# EasyEDA schematic PCB 10.2_2020-06-05_09-00-42.json
TITLE: Sheet_1; REV: 1.0; Date: 2020-06-05; Sheet: 1/1; Drawn By: Pravindu; Company: Your Company
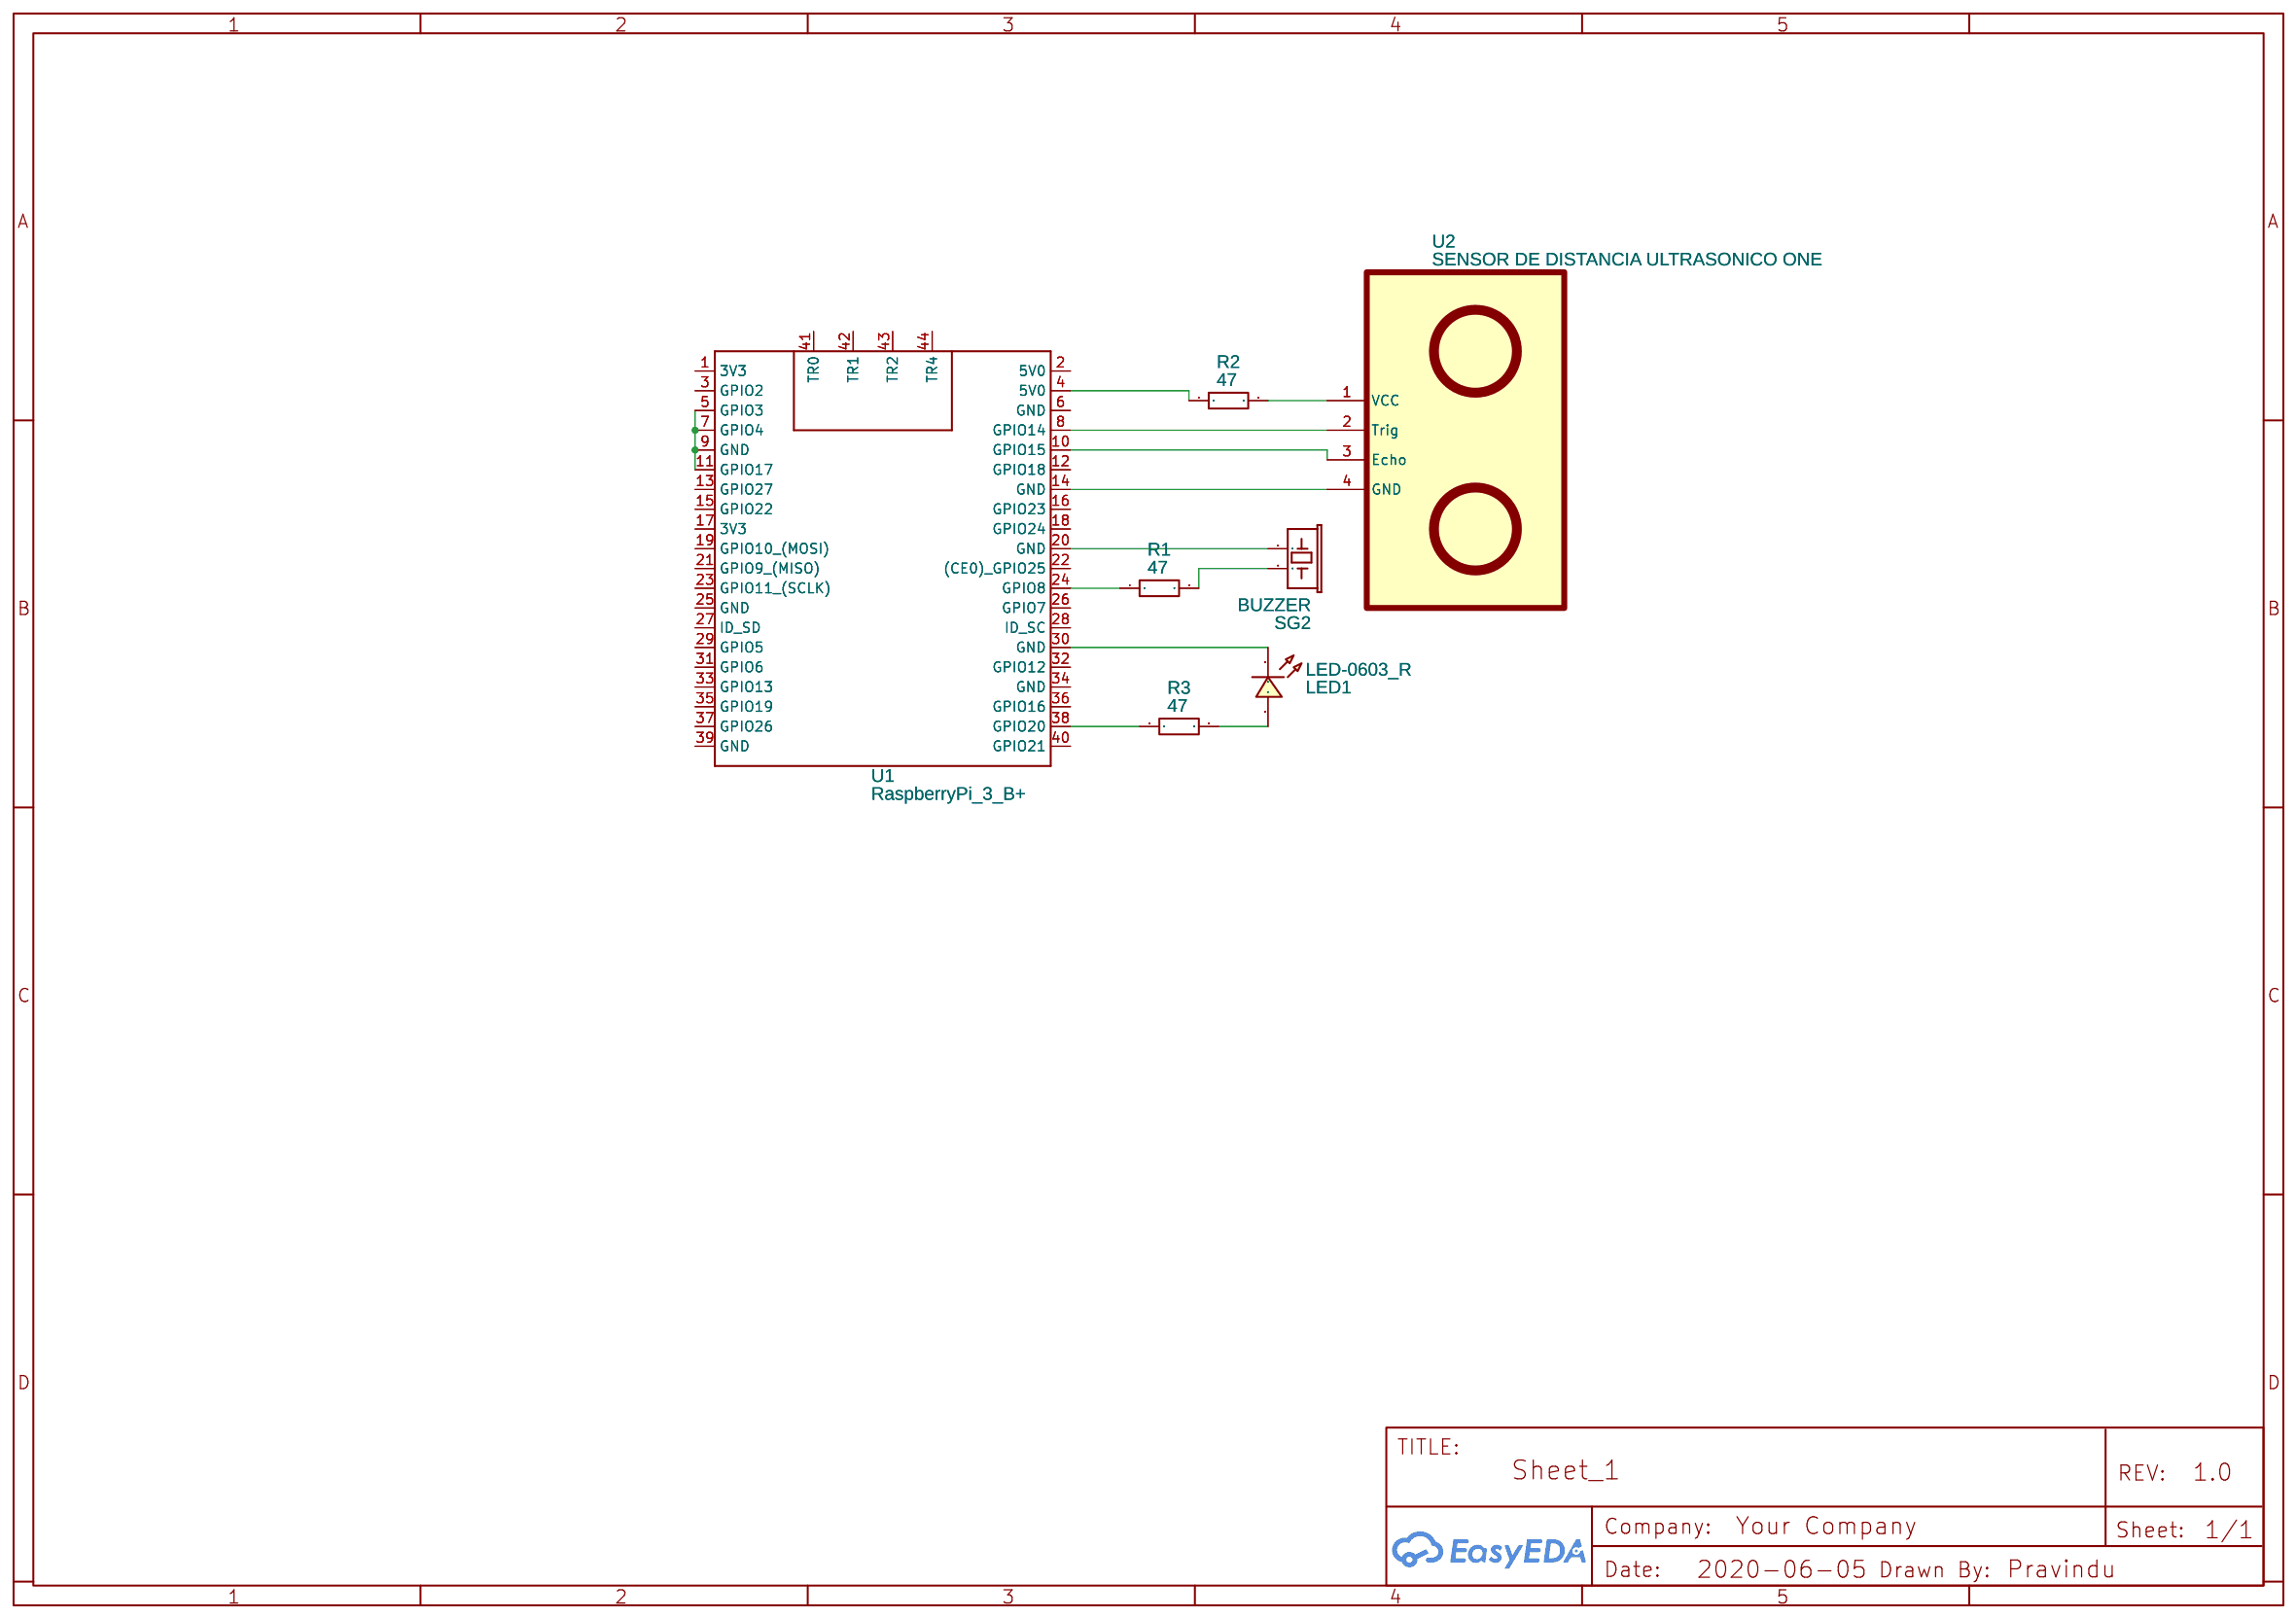
[diagram p0: schematic sheet]

## Parts
LED1  LED-0603_R  [LED0603_RED]
R1  47  [RES-TH_BD5.5-L16.0-P20.00-D0.8]
R2  47  [RES-TH_BD5.5-L16.0-P20.00-D0.8]
R3  47  [RES-TH_BD5.5-L16.0-P20.00-D0.8]
SG2  BUZZER  [BUZZER 14MM]
U1  RaspberryPi_3_B+  [RASBERRYPI_3_B+_POE]
U2  SENSOR DE DISTANCIA ULTRASONICO ONE  [SENSOR DE DISTANCIA ULTRASONIDO2]

## Library data of the parts
LED1 = LED-0603_R: Manufacturer: EVERLIGHT(台湾亿光); Manufacturer Part: 19-217/R6C-AL1M2VY/3T; Supplier Part: C72044; Supplier: LCSC; Contributor: LCEDA_01
R1-R3 = 47Ω(470) ±5%: Supplier: LCSC; Supplier Part: C209824; Manufacturer: Chian Chia Elec; Manufacturer Part: KNP2W-47Ω±5% MK型; Contributor: LCSC
SG2 = BUZZER: Contributor: SparkFun
U1 = RaspberryPi_3_B+: Manufacturer Part: RaspberryPi 3; Contributor: sebasiano
U2 = SENSOR DE DISTANCIA ULTRASONICO ONE: Contributor: blandinrafael30

## Nets
Net-(LED1-1): LED1.1 R3.2
Net-(LED1-2): LED1.2 U1.30(GND)
Net-(R1-1): R1.1 U1.24(GPIO8)
Net-(R1-2): R1.2 SG2.2
Net-(R2-1): R2.1 U1.4(5V0)
Net-(R2-2): R2.2 U2.1(VCC)
Net-(R3-1): R3.1 U1.38(GPIO20)
Net-(SG2-1): SG2.1 U1.20(GND)
Net-(U1-5): U1.5(GPIO3) U1.7(GPIO4) U1.9(GND) U1.11(GPIO17)
Net-(U1-8): U1.8(GPIO14) U2.2(Trig)
Net-(U1-10): U1.10(GPIO15) U2.3(Echo)
Net-(U1-14): U1.14(GND) U2.4(GND)

Not connected (* = marked no-connect by the designer): U1 1(3V3) 2(5V0) 3(GPIO2) 6(GND) 12(GPIO18) 13(GPIO27) 15(GPIO22) 16(GPIO23) 17(3V3) 18(GPIO24) 19(GPIO10 (MOSI)) 21(GPIO9 (MISO)) 22((CE0) GPIO25) 23(GPIO11 (SCLK)) 25(GND) 26(GPIO7) 27(ID_SD) 28(ID_SC) 29(GPIO5) 31(GPIO6) 32(GPIO12) 33(GPIO13) 34(GND) 35(GPIO19) 36(GPIO16) 37(GPIO26) 39(GND) 40(GPIO21) 41(TR0) 42(TR1) 43(TR2) 44(TR4)
